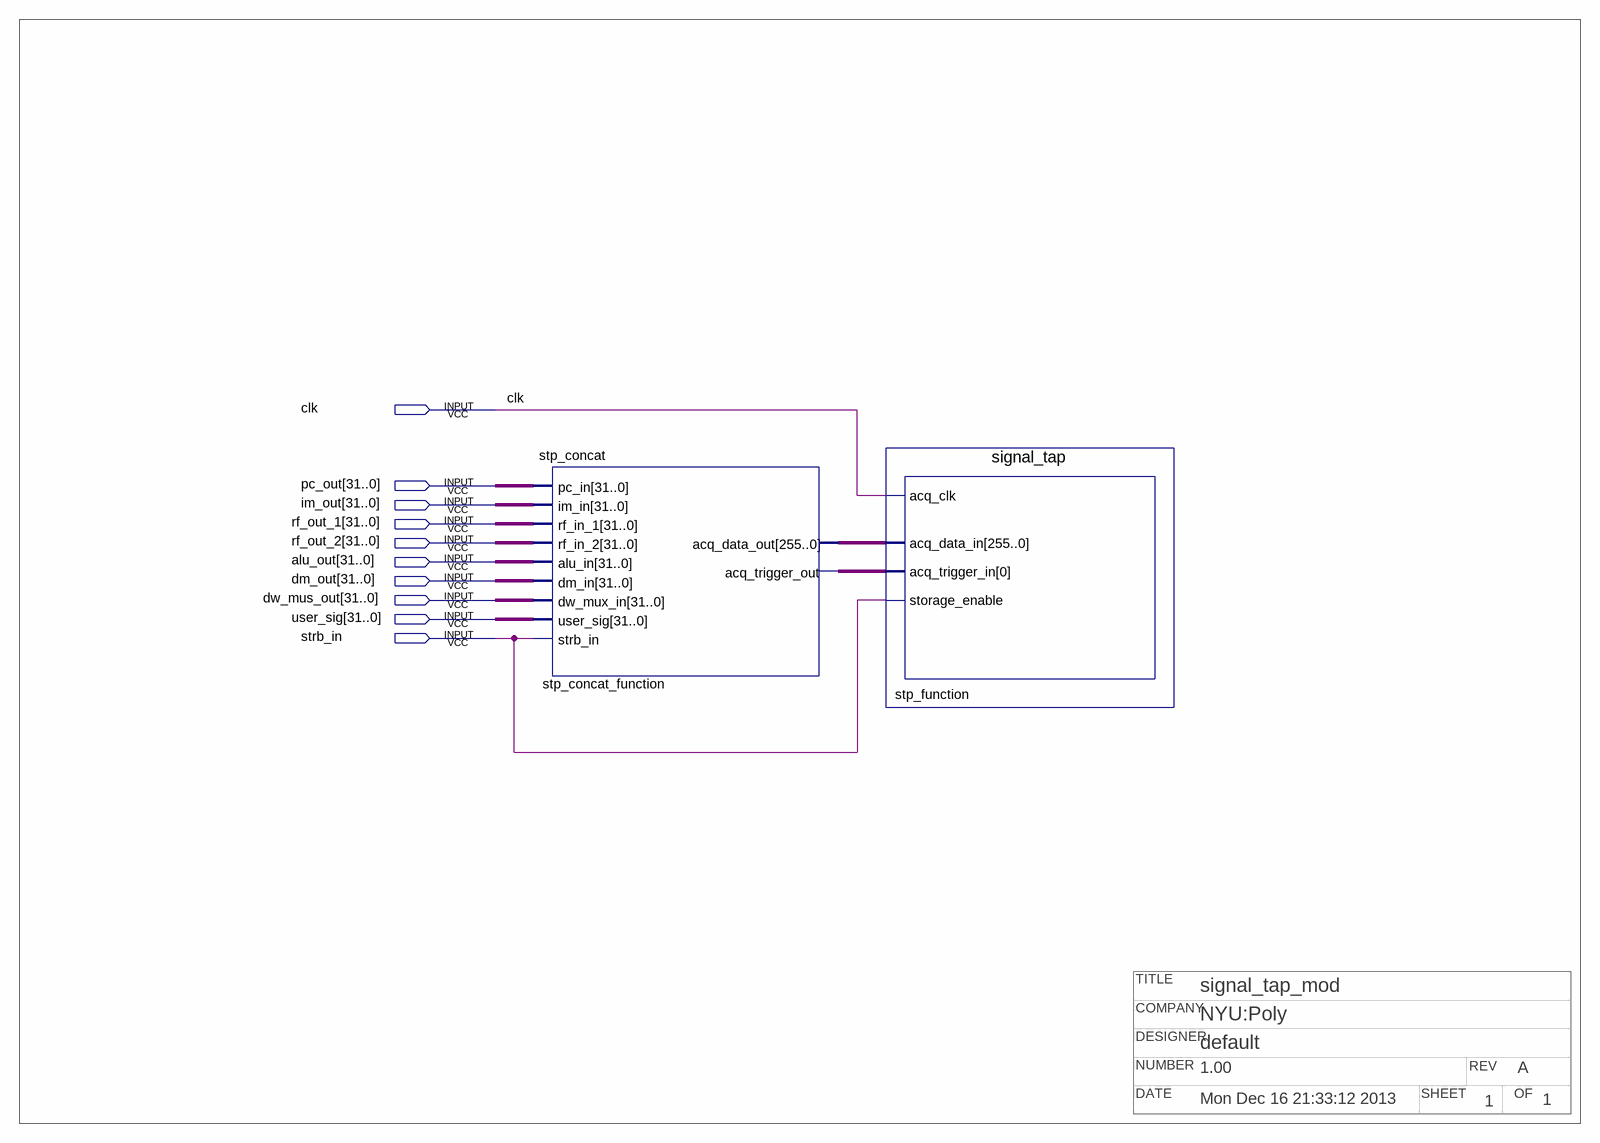
[diagram p0: schematic sheet]
// Quartus schematic signal_tap_mod.bdf as structural Verilog: 2 symbols, 10 pins
// Title block: COMPANY: NYU:Poly; DATE: Mon Dec 16 21:33:12 2013; DESIGNER: default; NUMBER: 1.00; OF: 1; REV: A; SHEET: 1; TITLE: signal_tap_mod
module signal_tap_mod (
  input  clk,
  input  [31:0] pc_out,
  input  [31:0] im_out,
  input  [31:0] rf_out_1,
  input  [31:0] rf_out_2,
  input  [31:0] alu_out,
  input  [31:0] dm_out,
  input  [31:0] dw_mus_out,
  input  [31:0] user_sig,
  input  strb_in
);

  wire stp_concat_function_acq_trigger_out;
  wire [255:0] stp_concat_function_acq_data_out;

  stp_concat stp_concat_function (
    .pc_in(pc_out), .im_in(im_out), .rf_in_1(rf_out_1), .rf_in_2(rf_out_2), .alu_in(alu_out), .dm_in(dm_out),
    .dw_mux_in(dw_mus_out), .user_sig(user_sig), .strb_in(strb_in),
    .acq_data_out(stp_concat_function_acq_data_out), .acq_trigger_out(stp_concat_function_acq_trigger_out));
  signal_tap stp_function (
    .acq_clk(clk), .acq_data_in(stp_concat_function_acq_data_out),
    .acq_trigger_in(stp_concat_function_acq_trigger_out), .storage_enable(strb_in));
endmodule
